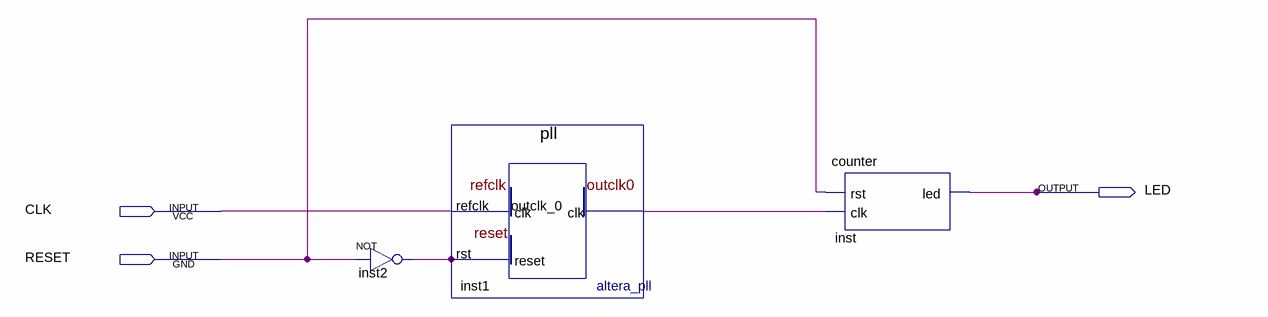
[diagram p0: schematic sheet]
// Quartus schematic hello-world.bdf as structural Verilog: 3 symbols, 3 pins
module \hello-world  (
  input  CLK,
  input  RESET,
  output LED
);

  wire inst1_outclk_0, inst2_out;

  not inst2 (inst2_out, RESET);
  pll inst1 (.refclk(CLK), .rst(inst2_out), .outclk_0(inst1_outclk_0));
  counter inst (.rst(RESET), .clk(inst1_outclk_0), .led(LED));
endmodule
